# EAGLE design platform_smd (EAGLE 6.5.0)
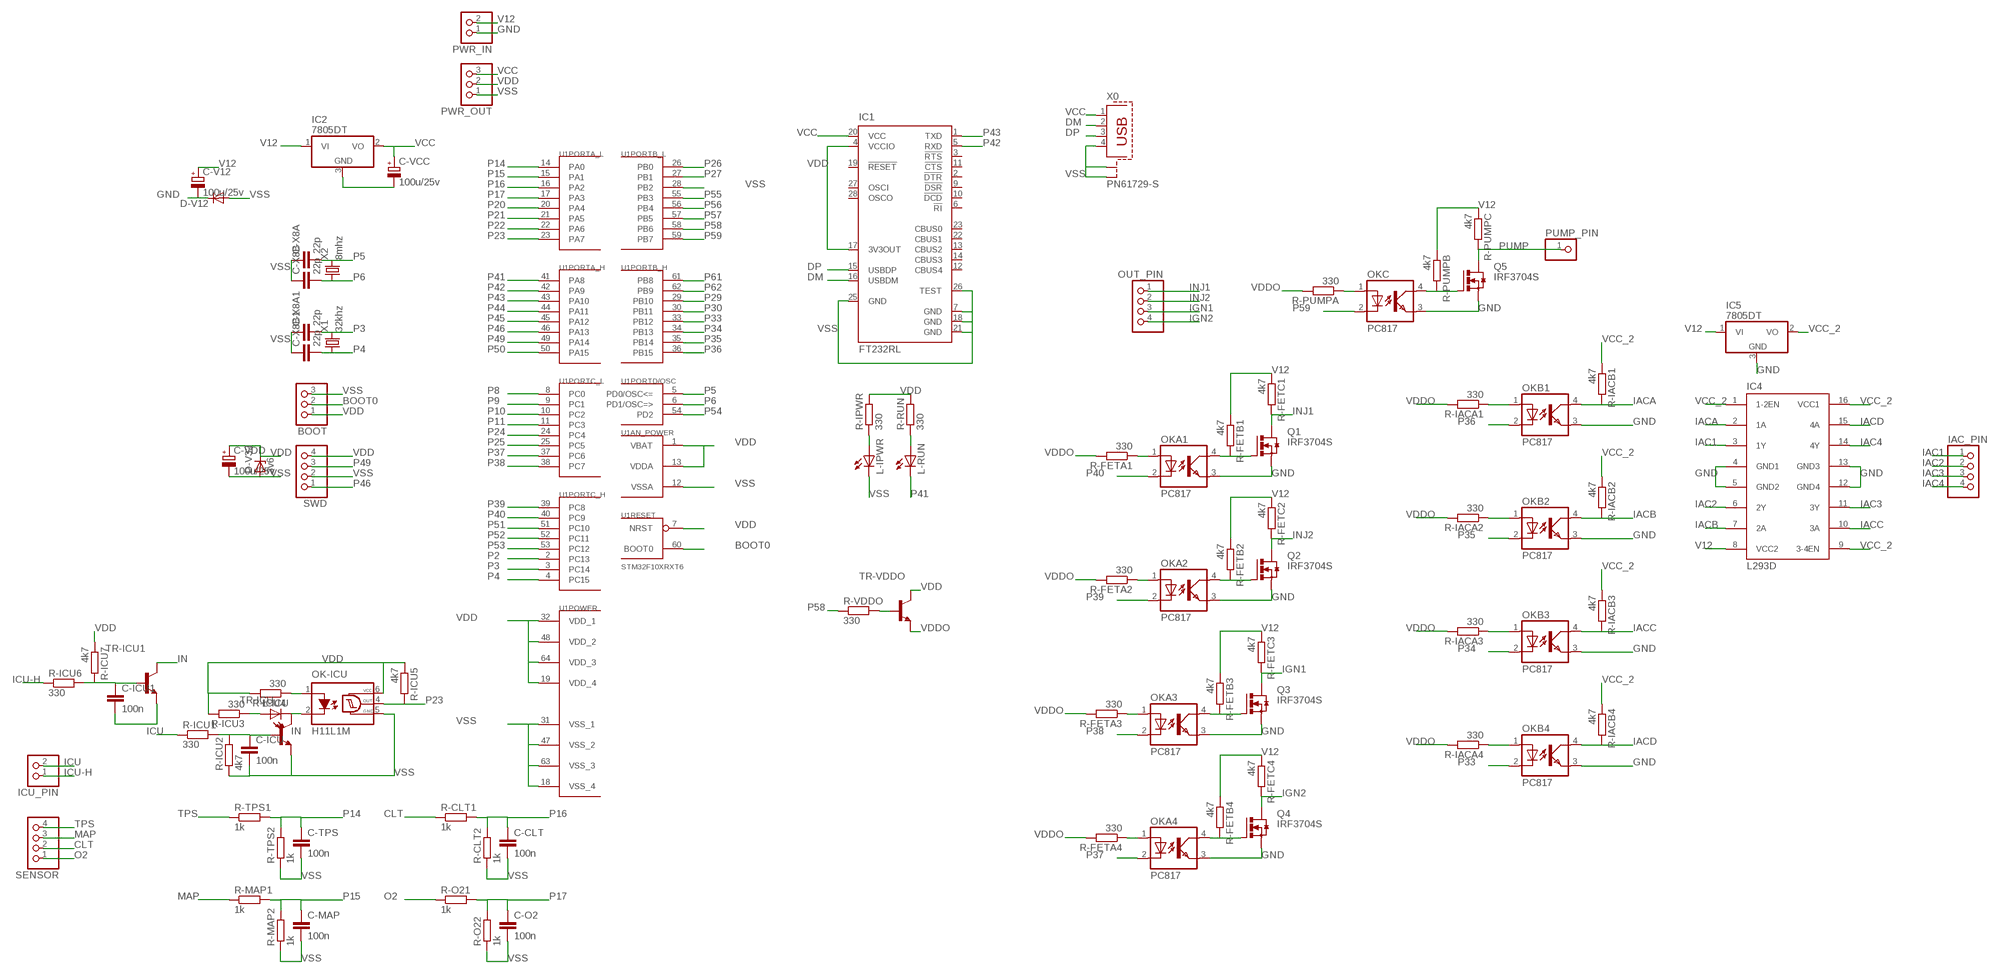
[diagram p0: schematic, sheet 1]

## Parts
BOOT  PINHD-1X3  [1X03]
C-CLT  100n  C-EUC0805  [C0805]
C-ICU  100n  C-EUC0805  [C0805]
C-ICU1  100n  C-EUC0805  [C0805]
C-MAP  100n  C-EUC0805  [C0805]
C-O2  100n  C-EUC0805  [C0805]
C-TPS  100n  C-EUC0805  [C0805]
C-V12  100u/25v  CPOL-EUD  [PANASONIC_D]
C-VCC  100u/25v  CPOL-EUD  [PANASONIC_D]
C-VDD  100u/25v  CPOL-EUD  [PANASONIC_D]
C-X8A  22p  C-EUC0805  [C0805]
C-X8A1  22p  C-EUC0805  [C0805]
C-X8B  22p  C-EUC0805  [C0805]
C-X8B1  22p  C-EUC0805  [C0805]
D-V12  DIODE-SMB  [SMB]
D-V33  3v6  ZENER-DIODESMB  [SMB]
IAC_PIN  PINHD-1X4  [1X04]
IC1  FT232RL  [SSOP28]
IC2  7805DT  [TO252]
IC4  L293D  [DIL16]
IC5  7805DT  [TO252]
ICU_PIN  PINHD-1X2  [1X02]
L-ICU  LEDSML0805  [SML0805]
L-IPWR  LEDSML0805  [SML0805]
L-RUN  LEDSML0805  [SML0805]
OK-ICU  H11L1M  [DIL06]
OKA1  PC817  [DIL04]
OKA2  PC817  [DIL04]
OKA3  PC817  [DIL04]
OKA4  PC817  [DIL04]
OKB1  PC817  [DIL04]
OKB2  PC817  [DIL04]
OKB3  PC817  [DIL04]
OKB4  PC817  [DIL04]
OKC  PC817  [DIL04]
OUT_PIN  PINHD-1X4  [1X04]
PUMP_PIN  PINHD-1X1  [1X01]
PWR_IN  PINHD-1X2  [1X02]
PWR_OUT  PINHD-1X3  [1X03]
Q1  IRF3704S  [D2PACK]
Q2  IRF3704S  [D2PACK]
Q3  IRF3704S  [D2PACK]
Q4  IRF3704S  [D2PACK]
Q5  IRF3704S  [D2PACK]
R-CLT1  1k  R-EU_R0805  [R0805]
R-CLT2  1k  R-EU_R0805  [R0805]
R-FETA1  330  R-EU_R0805  [R0805]
R-FETA2  330  R-EU_R0805  [R0805]
R-FETA3  330  R-EU_R0805  [R0805]
R-FETA4  330  R-EU_R0805  [R0805]
R-FETB1  4k7  R-EU_R0805  [R0805]
R-FETB2  4k7  R-EU_R0805  [R0805]
R-FETB3  4k7  R-EU_R0805  [R0805]
R-FETB4  4k7  R-EU_R0805  [R0805]
R-FETC1  4k7  R-EU_R0805  [R0805]
R-FETC2  4k7  R-EU_R0805  [R0805]
R-FETC3  4k7  R-EU_R0805  [R0805]
R-FETC4  4k7  R-EU_R0805  [R0805]
R-IACA1  330  R-EU_R0805  [R0805]
R-IACA2  330  R-EU_R0805  [R0805]
R-IACA3  330  R-EU_R0805  [R0805]
R-IACA4  330  R-EU_R0805  [R0805]
R-IACB1  4k7  R-EU_R0805  [R0805]
R-IACB2  4k7  R-EU_R0805  [R0805]
R-IACB3  4k7  R-EU_R0805  [R0805]
R-IACB4  4k7  R-EU_R0805  [R0805]
R-ICU1  330  R-EU_R0805  [R0805]
R-ICU2  4k7  R-EU_R0805  [R0805]
R-ICU3  330  R-EU_R0805  [R0805]
R-ICU4  330  R-EU_R0805  [R0805]
R-ICU5  4k7  R-EU_R0805  [R0805]
R-ICU6  330  R-EU_R0805  [R0805]
R-ICU7  4k7  R-EU_R0805  [R0805]
R-IPWR  330  R-EU_R0805  [R0805]
R-MAP1  1k  R-EU_R0805  [R0805]
R-MAP2  1k  R-EU_R0805  [R0805]
R-O21  1k  R-EU_R0805  [R0805]
R-O22  1k  R-EU_R0805  [R0805]
R-PUMPA  330  R-EU_R0805  [R0805]
R-PUMPB  4k7  R-EU_R0805  [R0805]
R-PUMPC  4k7  R-EU_R0805  [R0805]
R-RUN  330  R-EU_R0805  [R0805]
R-TPS1  1k  R-EU_R0805  [R0805]
R-TPS2  1k  R-EU_R0805  [R0805]
R-VDDO  330  R-EU_R0805  [R0805]
SENSOR  PINHD-1X4  [1X04]
SWD  PINHD-1X4  [1X04]
TR-ICU  MMBT3904LT1-NPN-SOT23-BEC  [SOT23-BEC]
TR-ICU1  MMBT3904LT1-NPN-SOT23-BEC  [SOT23-BEC]
TR-VDDO  MMBT3904LT1-NPN-SOT23-BEC  [SOT23-BEC]
U1  STM32F10XRXT6  [TQFP64]
X0  PN61729-S  [PN61729-S]
X1  32khz  CRYSTALTC26V  [TC26V]
X2  8mhz  CRYSTALHC49U-V  [HC49U-V]

## Nets
BOOT0: BOOT.2 U1.60(RESET:BOOT0)
CLT: R-CLT1.1 SENSOR.2
DM: IC1.16(USBDM) X0.2
DP: IC1.15(USBDP) X0.3
GND: C-V12.- D-V12.C IC4.4(GND1) IC4.5(GND2) IC4.12(GND4) IC4.13(GND3) IC5.3(GND) OKA1.3(EMIT) OKA2.3(EMIT) OKA3.3(EMIT) OKA4.3(EMIT) OKB1.3(EMIT) OKB2.3(EMIT) OKB3.3(EMIT) OKB4.3(EMIT) OKC.3(EMIT) PWR_IN.1 Q1.3(S) Q2.3(S) Q3.3(S) Q4.3(S) Q5.3(S)
IAC1: IAC_PIN.1 IC4.3(1Y)
IAC2: IAC_PIN.2 IC4.6(2Y)
IAC3: IAC_PIN.3 IC4.11(3Y)
IAC4: IAC_PIN.4 IC4.14(4Y)
IACA: IC4.2(1A) OKB1.4(COL) R-IACB1.2
IACB: IC4.7(2A) OKB2.4(COL) R-IACB2.2
IACC: IC4.10(3A) OKB3.4(COL) R-IACB3.2
IACD: IC4.15(4A) OKB4.4(COL) R-IACB4.2
ICU: ICU_PIN.2 R-ICU1.1
ICU-H: ICU_PIN.1 R-ICU6.1
IGN1: OUT_PIN.3 Q3.2(D) R-FETC3.2
IGN2: OUT_PIN.4 Q4.2(D) R-FETC4.2
IN: L-ICU.C OK-ICU.2(C) TR-ICU1.C TR-ICU.C
INJ1: OUT_PIN.1 Q1.2(D) R-FETC1.2
INJ2: OUT_PIN.2 Q2.2(D) R-FETC2.2
MAP: R-MAP1.1 SENSOR.3
N$1: C-ICU1.1 R-ICU6.2 R-ICU7.2 TR-ICU1.B
N$2: OKA2.4(COL) Q2.1(G) R-FETB2.2
N$3: C-ICU.1 R-ICU1.2 R-ICU2.2 TR-ICU.B
N$4: OKC.4(COL) Q5.1(G) R-PUMPB.2
N$5: OK-ICU.1(A) R-ICU4.1
N$6: L-ICU.A R-ICU3.1
N$7: L-IPWR.A R-IPWR.1
N$8: L-RUN.A R-RUN.1
N$9: OKC.1(A) R-PUMPA.1
N$10: OKB1.1(A) R-IACA1.1
N$11: OKA1.4(COL) Q1.1(G) R-FETB1.2
N$12: OKA2.1(A) R-FETA2.1
N$13: OKA1.1(A) R-FETA1.1
N$14: OKA3.4(COL) Q3.1(G) R-FETB3.2
N$15: OKA3.1(A) R-FETA3.1
N$16: OKA4.4(COL) Q4.1(G) R-FETB4.2
N$17: OKA4.1(A) R-FETA4.1
N$18: OKB2.1(A) R-IACA2.1
N$19: R-VDDO.2 TR-VDDO.B
N$21: OKB3.1(A) R-IACA3.1
N$22: OKB4.1(A) R-IACA4.1
O2: R-O21.1 SENSOR.1
P2: U1.2(PORTC_H:PC13)
P3: C-X8A1.2 U1.3(PORTC_H:PC14) X1.2
P4: C-X8B1.2 U1.4(PORTC_H:PC15) X1.1
P5: C-X8A.2 U1.5(PORTD/OSC:PD0/OSC<=) X2.2
P6: C-X8B.2 U1.6(PORTD/OSC:PD1/OSC=>) X2.1
P8: U1.8(PORTC_L:PC0)
P9: U1.9(PORTC_L:PC1)
P10: U1.10(PORTC_L:PC2)
P11: U1.11(PORTC_L:PC3)
P14: C-TPS.1 R-TPS1.2 R-TPS2.2 U1.14(PORTA_L:PA0)
P15: C-MAP.1 R-MAP1.2 R-MAP2.2 U1.15(PORTA_L:PA1)
P16: C-CLT.1 R-CLT1.2 R-CLT2.2 U1.16(PORTA_L:PA2)
P17: C-O2.1 R-O21.2 R-O22.2 U1.17(PORTA_L:PA3)
P20: U1.20(PORTA_L:PA4)
P21: U1.21(PORTA_L:PA5)
P22: U1.22(PORTA_L:PA6)
P23: OK-ICU.4(OUT) R-ICU5.2 U1.23(PORTA_L:PA7)
P24: U1.24(PORTC_L:PC4)
P25: U1.25(PORTC_L:PC5)
P26: U1.26(PORTB_L:PB0)
P27: U1.27(PORTB_L:PB1)
P29: U1.29(PORTB_H:PB10)
P30: U1.30(PORTB_H:PB11)
P33: OKB4.2(C) U1.33(PORTB_H:PB12)
P34: OKB3.2(C) U1.34(PORTB_H:PB13)
P35: OKB2.2(C) U1.35(PORTB_H:PB14)
P36: OKB1.2(C) U1.36(PORTB_H:PB15)
P37: OKA4.2(C) U1.37(PORTC_L:PC6)
P38: OKA3.2(C) U1.38(PORTC_L:PC7)
P39: OKA2.2(C) U1.39(PORTC_H:PC8)
P40: OKA1.2(C) U1.40(PORTC_H:PC9)
P41: L-RUN.C U1.41(PORTA_H:PA8)
P42: IC1.5(RXD) U1.42(PORTA_H:PA9)
P43: IC1.1(TXD) U1.43(PORTA_H:PA10)
P44: U1.44(PORTA_H:PA11)
P45: U1.45(PORTA_H:PA12)
P46: SWD.1 U1.46(PORTA_H:PA13)
P49: SWD.3 U1.49(PORTA_H:PA14)
P50: U1.50(PORTA_H:PA15)
P51: U1.51(PORTC_H:PC10)
P52: U1.52(PORTC_H:PC11)
P53: U1.53(PORTC_H:PC12)
P54: U1.54(PORTD/OSC:PD2)
P55: U1.55(PORTB_L:PB3)
P56: U1.56(PORTB_L:PB4)
P57: U1.57(PORTB_L:PB5)
P58: R-VDDO.1 U1.58(PORTB_L:PB6)
P59: OKC.2(C) U1.59(PORTB_L:PB7)
P61: U1.61(PORTB_H:PB8)
P62: U1.62(PORTB_H:PB9)
PUMP: PUMP_PIN.1 Q5.2(D) R-PUMPC.2
TPS: R-TPS1.1 SENSOR.4
V12: C-V12.+ IC2.1(VI) IC4.8(VCC2) IC5.1(VI) PWR_IN.2 R-FETB1.1 R-FETB2.1 R-FETB3.1 R-FETB4.1 R-FETC1.1 R-FETC2.1 R-FETC3.1 R-FETC4.1 R-PUMPB.1 R-PUMPC.1
VCC: C-VCC.+ IC1.20(VCC) IC2.2(VO) PWR_OUT.3 X0.1
VCC_2: IC4.1(1-2EN) IC4.9(3-4EN) IC4.16(VCC1) IC5.2(VO) R-IACB1.1 R-IACB2.1 R-IACB3.1 R-IACB4.1
VDD: BOOT.1 C-VDD.+ D-V33.C IC1.4(VCCIO) IC1.17(3V3OUT) OK-ICU.6(VCC) PWR_OUT.2 R-ICU3.2 R-ICU4.2 R-ICU5.1 R-ICU7.1 R-IPWR.2 R-RUN.2 SWD.4 TR-VDDO.C U1.1(AN_POWER:VBAT) U1.7(RESET:NRST) U1.13(AN_POWER:VDDA) U1.19(POWER:VDD_4) U1.32(POWER:VDD_1) U1.48(POWER:VDD_2) U1.64(POWER:VDD_3)
VDDO: R-FETA1.2 R-FETA2.2 R-FETA3.2 R-FETA4.2 R-IACA1.2 R-IACA2.2 R-IACA3.2 R-IACA4.2 R-PUMPA.2 TR-VDDO.E
VSS: BOOT.3 C-CLT.2 C-ICU.2 C-MAP.2 C-O2.2 C-TPS.2 C-VCC.- C-VDD.- C-X8A1.1 C-X8A.1 C-X8B1.1 C-X8B.1 D-V12.A D-V33.A IC1.7(GND) IC1.18(GND) IC1.21(GND) IC1.25(GND) IC1.26(TEST) IC2.3(GND) L-IPWR.C OK-ICU.5(GND) PWR_OUT.1 R-CLT2.1 R-ICU2.1 R-MAP2.1 R-O22.1 R-TPS2.1 SWD.2 TR-ICU.E U1.12(AN_POWER:VSSA) U1.18(POWER:VSS_4) U1.28(PORTB_L:PB2) U1.31(POWER:VSS_1) U1.47(POWER:VSS_2) U1.63(POWER:VSS_3) X0.4 X0.S1 X0.S2
VSS1: C-ICU1.2 TR-ICU1.E
Unconnected: IC1.2(!DTR) IC1.3(!RTS) IC1.6(!RI) IC1.9(!DSR) IC1.10(!DCD) IC1.11(!CTS) IC1.12(CBUS4) IC1.13(CBUS2) IC1.14(CBUS3) IC1.19(!RESET) IC1.22(CBUS1) IC1.23(CBUS0) IC1.27(OSCI) IC1.28(OSCO)

## Library data of the parts
BOOT PWR_OUT = pinhead:PINHD-1X3: PIN HEADER
C-CLT C-ICU C-ICU1 C-MAP C-O2 C-TPS C-X8A C-X8A1 C-X8B C-X8B1 = resistor:C-EU: CAPACITOR, European symbol
C-V12 C-VCC C-VDD = resistor:CPOL-EU: POLARIZED CAPACITOR, European symbol
D-V12 = diode:DIODE-: DIODE
D-V33 = diode:ZENER-DIODE: Z-Diode
IAC_PIN OUT_PIN SENSOR SWD = pinhead:PINHD-1X4: PIN HEADER
IC1 = ftdichip:FT232R: Source: http://www.ftdichip.com/Documents/DataSheets/DS_FT232R_v104.pdf; MPN: FT232RL; OC_FARNELL: 1146032; OC_NEWARK: 91K9918
IC2 IC5 = linear:78*: Positive VOLTAGE REGULATOR Source: http://cache.national.com/ds/LM/LM78L05.pdf http://www.fairchildsemi.com/ds/LM/LM7805.pdf
IC4 = st-microelectronics:L293D: PUSH-PULL 4 CHANNEL DRIVER; MPN: L293D; OC_FARNELL: 9589619; OC_NEWARK: 56P8249
ICU_PIN PWR_IN = pinhead:PINHD-1X2: PIN HEADER
L-ICU L-IPWR L-RUN = led:LED: LED OSRAM: - CHIPLED LG R971, LG N971, LY N971, LG Q971, LY Q971, LO R971, LY R971 LH N974, LH R974 LS Q976, LO Q976, LY Q976 LO Q996 - Hyper CHIPLED LW Q18S LB Q993, LB Q99A, LB R99A - SideLED LS A670, LO A670, LY A670, LG A670, LP A670 LB A673, LV A673, LT A673, LW A673 LH A674 LY A675 LS A676, LA A676, LO A676, LY A676, LW A676 LS A679, LY A679, LG A679 - Hyper Micro SIDELED® LS Y876, LA Y876, LO Y876, LY Y876 LT Y87S - SmartLED LW L88C, LW L88S LB L89C, LB L89S, LG L890 LS L89K, LO L89K, LY L89K LS L896, LA L896, LO L896, LY L896 - TOPLED LS T670, LO T670, LY T670, LG T670, LP T670 LSG T670, LSP T670, LSY T670, LOP T670, LYG T670 LG T671, LOG T671, LSG T671 LB T673, LV T673, LT T673, LW T673 LH T674 LS T676, LA T676, LO T676, LY T676, LB T676, LH T676, LSB T676, LW T676 LB T67C, LV T67C, LT T67C, LS T67K, LO T67K, LY T67K, LW E67C LS E67B, LA E67B, LO E67B, LY E67B, LB E67C, LV E67C, LT E67C LW T67C LS T679, LY T679, LG T679 LS T770, LO T770, LY T770, LG T770, LP T770 LB T773, LV T773, LT T773, LW T773 LH T774 LS E675, LA E675, LY E675, LS T675 LS T776, LA T776, LO T776, LY T776, LB T776 LHGB T686 LT T68C, LB T68C - Hyper Mini TOPLED® LB M676 - Mini TOPLED Santana® LG M470 LS M47K, LO M47K, LY M47K Source: http://www.osram.convergy.de LUXEON: - LUMILED® LXK2-PW12-R00, LXK2-PW12-S00, LXK2-PW14-U00, LXK2-PW14-V00 LXK2-PM12-R00, LXK2-PM12-S00, LXK2-PM14-U00 LXK2-PE12-Q00, LXK2-PE12-R00, LXK2-PE12-S00, LXK2-PE14-T00, LXK2-PE14-U00 LXK2-PB12-K00, LXK2-PB12-L00, LXK2-PB12-M00, LXK2-PB14-N00, LXK2-PB14-P00, LXK2-PB14-Q00 LXK2-PR12-L00, LXK2-PR12-M00, LXK2-PR14-Q00, LXK2-PR14-R00 LXK2-PD12-Q00, LXK2-PD12-R00, LXK2-PD12-S00 LXK2-PH12-R00, LXK2-PH12-S00 LXK2-PL12-P00, LXK2-PL12-Q00, LXK2-PL12-R00 Source: www.luxeon.com KINGBRIGHT: KA-3528ASYC Source: www.kingbright.com
OK-ICU = optocoupler:H11L*M: 6-Pin DIP Optocoupler Source: http://www.fairchildsemi.com/ds/H1/H11L2-M.pdf; MF: FAIRCHILD SEMICONDUCTOR; MPN: H11L1-M; OC_FARNELL: 1021127; OC_NEWARK: 72K8643
OKA1-OKA4 OKB1-OKB4 OKC = optocoupler:PC817: SHARP OPTO COUPLER; MPN: PC817X4J000F; OC_FARNELL: 9707727; OC_NEWARK: 97K7059
PUMP_PIN = pinhead:PINHD-1X1: PIN HEADER
Q1-Q5 = transistor-power:IRF3704: SMPS MOSFET HEXFET® Power MOSFET Source: http://www.irf.com/product-info/datasheets/data/irf3704.pdf
R-CLT1 R-CLT2 R-FETA1-R-FETA4 R-FETB1-R-FETB4 R-FETC1-R-FETC4 R-IACA1-R-IACA4 R-IACB1-R-IACB4 R-ICU1-R-ICU7 R-IPWR R-MAP1 R-MAP2 R-O21 R-O22 R-PUMPA R-PUMPB R-PUMPC R-RUN R-TPS1 R-TPS2 R-VDDO = resistor:R-EU_: RESISTOR, European symbol
TR-ICU TR-ICU1 TR-VDDO = transistor:*-NPN-: NPN Transistror BF959 corrected 2008.03.06
U1 = stm32:STM32F10XRXT6: STM32F101/103 64pin LQFP
X0 = con-berg:PN61729-S: BERG USB connector; OC_FARNELL: unknown; OC_NEWARK: unknown
X1 = crystal:CRYSTAL: CRYSTAL; OC_FARNELL: unknown; OC_NEWARK: unknown
X2 = crystal:CRYSTAL: CRYSTAL; OC_FARNELL: 1666969; OC_NEWARK: unknown

## Board
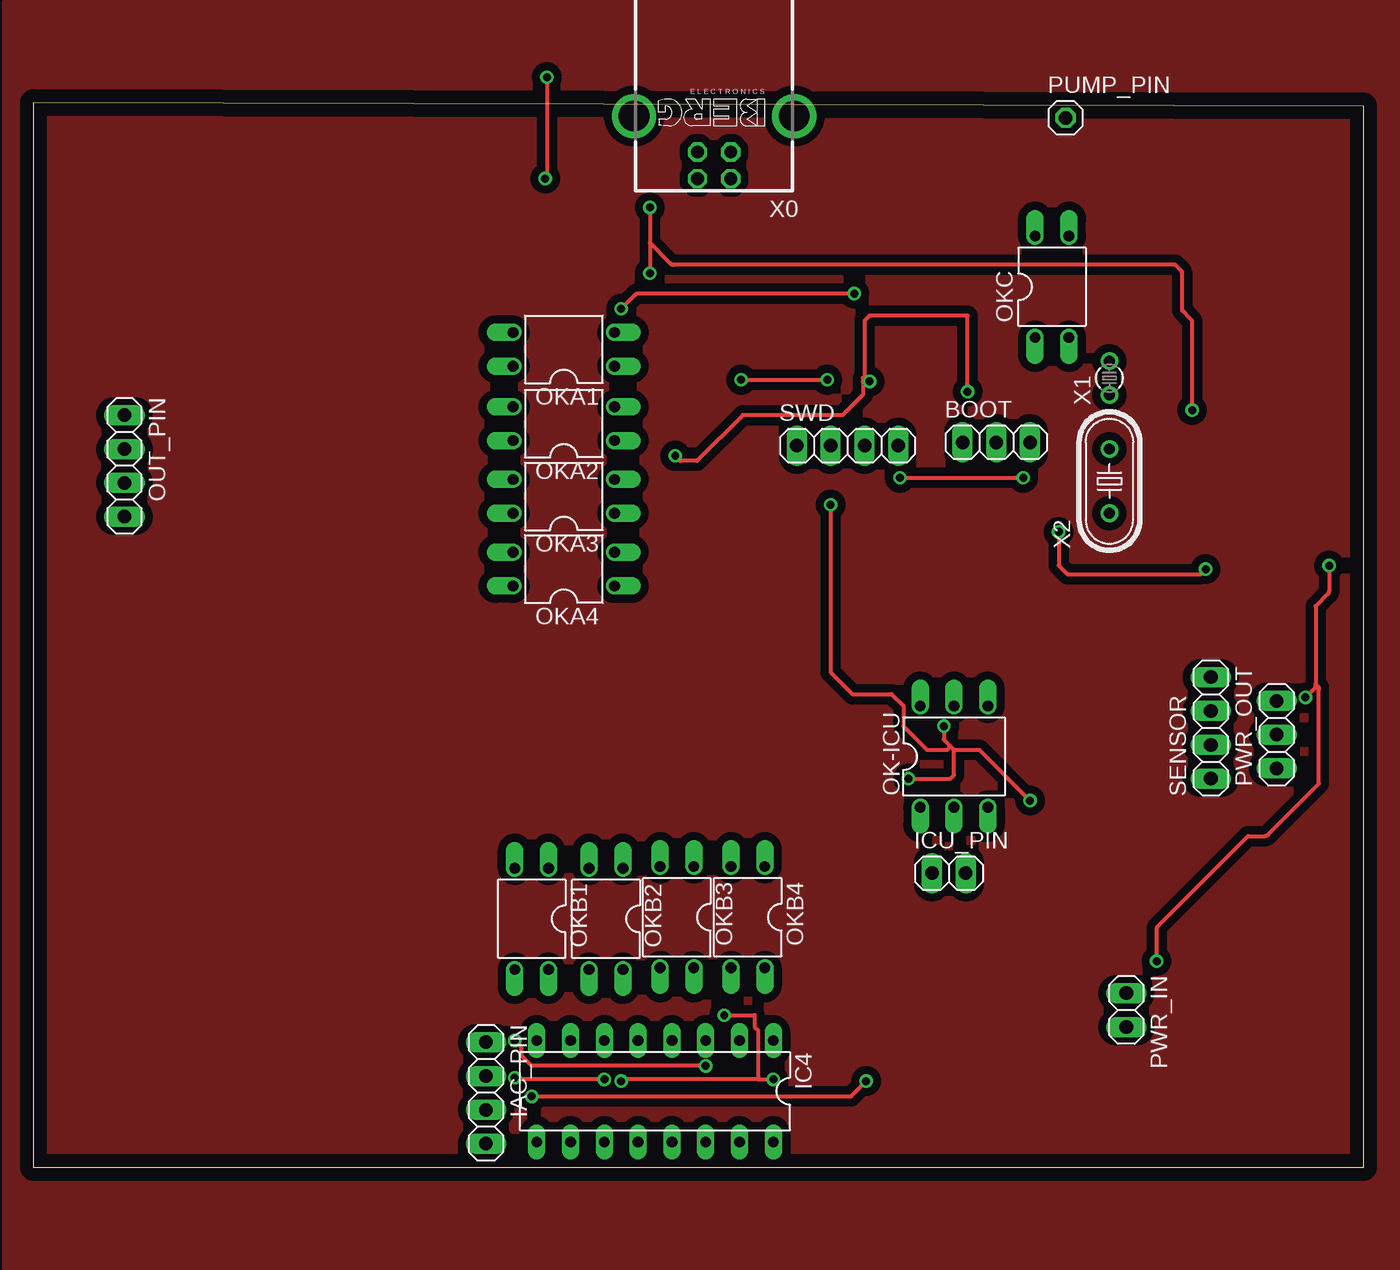
[diagram p1: board, top side]
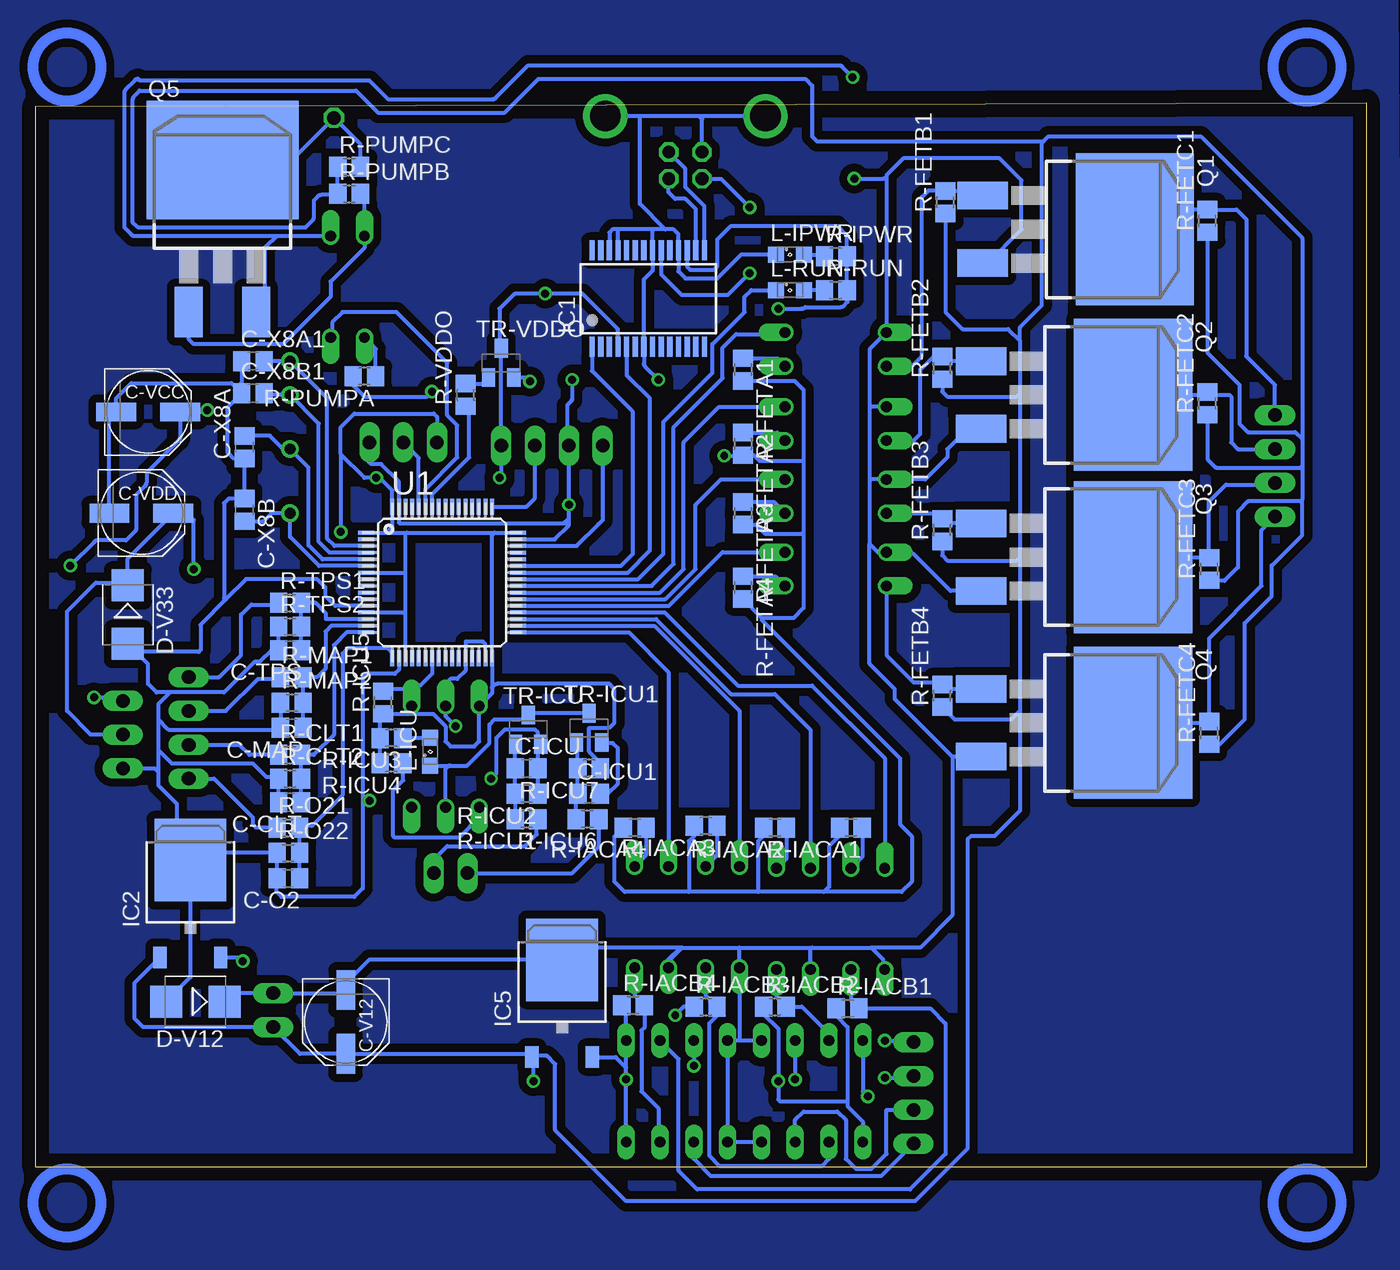
[diagram p2: board, bottom side, seen from below]

Size 100 x 80 mm. Coordinates in mm from the lower left corner, seen from the top.
Outline: 0,0 100,0 100,79.75 0,80 0,0
Copper layers (1*16): Top 0.035mm / dielectric 1.5mm / Bottom 0.035mm
Design rules "default": minimum track width 10mil, minimum drill 24mil, track to track 8mil, track to pad 8mil, pad to pad 8mil, via to via 8mil, smd to smd 8mil, copper to edge 40mil, drill to drill 8mil, minimum pad ring 10mil, minimum via ring 8mil, stop-mask expansion 4mil, vias tented up to drill 0mil, thermal gap 10mil

### Footprints (pad centres in the part's own frame; a part is rotated, then mirrored left to right if it is on the bottom)
1X03 = drill 1.016 long: 1 -2.54,0; 2 0,0; 3 2.54,0
C0805 = smd 1.3 x 1.5: 1 -0.85,0; 2 0.85,0
PANASONIC_D = smd 3 x 1.4: + 2.4,0; - -2.4,0
SMB = smd 2.4 x 2.4: A 2.2,0; C -2.2,0
1X04 = drill 1.016 long: 1 -3.81,0; 2 -1.27,0; 3 1.27,0; 4 3.81,0
SSOP28 = smd 0.4 x 1.5: 1 -4.225,-3.625; 2 -3.575,-3.625; 3 -2.925,-3.625; 4 -2.275,-3.625; 5 -1.625,-3.625; 6 -0.975,-3.625; 7 -0.325,-3.625; 8 0.325,-3.625; 9 0.975,-3.625; 10 1.625,-3.625; 11 2.275,-3.625; 12 2.925,-3.625; 13 3.575,-3.625; 14 4.225,-3.625; 15 4.225,3.625; 16 3.575,3.625; 17 2.925,3.625; 18 2.275,3.625; 19 1.625,3.625; 20 0.975,3.625; 21 0.325,3.625; 22 -0.325,3.625; 23 -0.975,3.625; 24 -1.625,3.625; 25 -2.275,3.625; 26 -2.925,3.625; 27 -3.575,3.625; 28 -4.225,3.625
TO252 = smd 1 x 1.6: 1 -2.28,-4.8; 2 2.28,-4.8 | smd 5.4 x 6.2: 3 0,2.5
DIL16 = drill 0.813 long: 1 -8.89,-3.81; 2 -6.35,-3.81; 3 -3.81,-3.81; 4 -1.27,-3.81; 5 1.27,-3.81; 6 3.81,-3.81; 7 6.35,-3.81; 8 8.89,-3.81; 9 8.89,3.81; 10 6.35,3.81; 11 3.81,3.81; 12 1.27,3.81; 13 -1.27,3.81; 14 -3.81,3.81; 15 -6.35,3.81; 16 -8.89,3.81
1X02 = drill 1.016 long: 1 -1.27,0; 2 1.27,0
SML0805 = smd 1.2 x 1.2: A 1.05,0; C -1.05,0
DIL06 = drill 0.813 offset: 1 -2.54,-3.81; 2 0,-3.81; 3 2.54,-3.81; 4 2.54,3.81; 5 0,3.81; 6 -2.54,3.81
DIL04 = drill 0.813 offset: 1 -1.27,-3.81; 2 1.27,-3.81; 3 1.27,3.81; 4 -1.27,3.81
1X01 = drill 1.016 octagon: 1 0,0
D2PACK = smd 2.083 x 3.81: 1 -2.54,-8.89; 3 2.54,-8.89 | smd 11.43 x 8.89: 2 0,2.54
R0805 = smd 1.3 x 1.5: 1 -0.85,0; 2 0.85,0
SOT23-BEC = smd 1 x 1.4: B -0.95,-1.1; C 0,1.1; E 0.95,-1.1
TQFP64 = smd 1.2 x 0.3: 1 -5.7,3.75; 2 -5.7,3.25; 3 -5.7,2.75; 4 -5.7,2.25; 5 -5.7,1.75; 6 -5.7,1.25; 7 -5.7,0.75; 8 -5.7,0.25; 9 -5.7,-0.25; 10 -5.7,-0.75; 11 -5.7,-1.25; 12 -5.7,-1.75; 13 -5.7,-2.25; 14 -5.7,-2.75; 15 -5.7,-3.25; 16 -5.7,-3.75; 33 5.7,-3.75; 34 5.7,-3.25; 35 5.7,-2.75; 36 5.7,-2.25; 37 5.7,-1.75; 38 5.7,-1.25; 39 5.7,-0.75; 40 5.7,-0.25; 41 5.7,0.25; 42 5.7,0.75; 43 5.7,1.25; 44 5.7,1.75; 45 5.7,2.25; 46 5.7,2.75; 47 5.7,3.25; 48 5.7,3.75 | smd 0.3 x 1.2: 17 -3.75,-5.7; 18 -3.25,-5.7; 19 -2.75,-5.7; 20 -2.25,-5.7; 21 -1.75,-5.7; 22 -1.25,-5.7; 23 -0.75,-5.7; 24 -0.25,-5.7; 25 0.25,-5.7; 26 0.75,-5.7; 27 1.25,-5.7; 28 1.75,-5.7; 29 2.25,-5.7; 30 2.75,-5.7; 31 3.25,-5.7; 32 3.75,-5.7; 49 3.75,5.7; 50 3.25,5.7; 51 2.75,5.7; 52 2.25,5.7; 53 1.75,5.7; 54 1.25,5.7; 55 0.75,5.7; 56 0.25,5.7; 57 -0.25,5.7; 58 -0.75,5.7; 59 -1.25,5.7; 60 -1.75,5.7; 61 -2.25,5.7; 62 -2.75,5.7; 63 -3.25,5.7; 64 -3.75,5.7
PN61729-S = drill 0.95 octagon: 1 1.25,4.71; 2 -1.25,4.71; 3 -1.25,2.71; 4 1.25,2.71 | drill 2.3 pad 2.9: S1 -6.02,0; S2 6.02,0
TC26V = drill 0.813: 1 -1.27,0; 2 1.27,0
HC49U-V = drill 0.813: 1 -2.413,0; 2 2.413,0

### Placement (x,y rotation side)
BOOT  72.39,54.48 0 top
C-CLT  80.9,27.43 180 bottom
C-ICU  63.12,29.97 0 bottom
C-ICU1  58.42,28.07 0 bottom
C-MAP  80.77,33.02 180 bottom
C-O2  81.03,21.72 180 bottom
C-TPS  80.9,38.86 180 bottom
C-V12  76.71,10.92 270 bottom
C-VCC  91.57,56.77 0 bottom
C-VDD  92.08,49.15 0 bottom
C-X8A  84.33,54.1 90 bottom
C-X8A1  83.69,60.58 0 bottom
C-X8B  84.33,49.4 270 bottom
C-X8B1  83.69,58.17 0 bottom
D-V12  88.01,12.45 180 bottom
D-V33  93.09,41.53 270 bottom
IAC_PIN  34.04,5.59 270 top
IC1  53.98,65.28 0 bottom
IC2  88.39,20.57 0 bottom
IC4  46.74,5.71 180 top
IC5  60.45,13.08 0 bottom
ICU_PIN  68.83,22.1 0 top
L-ICU  70.36,31.24 90 bottom
L-IPWR  43.31,68.58 0 bottom
L-RUN  43.31,65.91 0 bottom
OK-ICU  69.22,30.86 0 top
OKA1  39.88,61.47 90 top
OKA2  39.88,55.88 90 top
OKA3  39.88,50.42 90 top
OKA4  39.88,44.96 90 top
OKB1  37.47,18.67 180 top
OKB2  43.05,18.67 180 top
OKB3  48.39,18.8 180 top
OKB4  53.72,18.8 180 top
OKC  76.58,66.17 0 top
OUT_PIN  6.86,52.7 270 top
PUMP_PIN  77.6,78.87 0 top
PWR_IN  82.17,11.81 270 top
PWR_OUT  93.47,32.51 90 top
Q1  19.94,70.48 270 bottom
Q2  20.07,58.04 270 bottom
Q3  20.07,45.85 270 bottom
Q4  20.07,33.4 270 bottom
Q5  85.98,73.15 0 bottom
R-CLT1  80.9,30.99 0 bottom
R-CLT2  80.9,29.21 0 bottom
R-FETA1  46.86,59.94 270 bottom
R-FETA2  46.86,54.36 270 bottom
R-FETA3  46.86,49.15 270 bottom
R-FETA4  46.86,43.56 270 bottom
R-FETB1  31.62,72.52 90 bottom
R-FETB2  31.88,60.07 90 bottom
R-FETB3  31.88,47.88 90 bottom
R-FETB4  31.88,35.43 90 bottom
R-FETC1  11.94,71.12 90 bottom
R-FETC2  11.94,57.4 90 bottom
R-FETC3  11.81,44.96 90 bottom
R-FETC4  11.81,32.64 90 bottom
R-IACA1  38.73,25.53 180 bottom
R-IACA2  44.45,25.53 180 bottom
R-IACA3  49.66,25.65 180 bottom
R-IACA4  54.99,25.53 180 bottom
R-IACB1  38.99,11.94 0 bottom
R-IACB2  44.45,12.06 0 bottom
R-IACB3  49.66,12.06 0 bottom
R-IACB4  55.12,12.19 0 bottom
R-ICU1  63.12,26.16 180 bottom
R-ICU2  63.12,28.07 180 bottom
R-ICU3  73.28,32.26 180 bottom
R-ICU4  73.28,30.35 180 bottom
R-ICU5  73.91,34.92 90 bottom
R-ICU6  58.55,26.16 180 bottom
R-ICU7  58.42,29.97 180 bottom
R-IPWR  39.88,68.45 0 bottom
R-MAP1  80.77,36.83 0 bottom
R-MAP2  80.77,34.92 0 bottom
R-O21  81.03,25.53 0 bottom
R-O22  81.03,23.62 0 bottom
R-PUMPA  75.31,59.44 180 bottom
R-PUMPB  76.45,73.15 0 bottom
R-PUMPC  76.45,75.18 0 bottom
R-RUN  39.88,65.91 0 bottom
R-TPS1  80.9,42.42 0 bottom
R-TPS2  80.9,40.64 0 bottom
R-VDDO  67.69,58.04 90 bottom
SENSOR  88.52,33.02 90 top
SWD  61.21,54.23 0 top
TR-ICU  62.99,32.89 0 bottom
TR-ICU1  58.42,33.02 0 bottom
TR-VDDO  65.02,60.45 0 bottom
U1  69.47,43.94 0 bottom
X0  51.18,78.99 180 top
X1  80.9,59.31 90 top
X2  80.9,51.56 90 top

### Tracks (layer width: path | path; a pad name or v marks a point on that pad's centre or on a via)
BOOT0
  Bottom 0.305: U1.60 71.22,53.31 BOOT.2
CLT
  Bottom 0.305: SENSOR.2 84.71,31.75 83.95,30.99 R-CLT1.1
DM
  Bottom 0.305: IC1.16 50.4,71.99 51.18,72.77 51.94,72.77 52.45,73.28 52.45,74.26 X0.2
DP
  Bottom 0.305: IC1.15 49.75,72.23 51.18,73.66 51.18,75.03 X0.3
GND  (via drill 0.6)
  Top 0.305: v38.61,81.92 38.61,74.55 arc-45 38.52,74.33 v38.48,74.3
  Bottom 0.305: Q5.3 82.8,64.9 82.8,69.09 81.92,69.98 OKC.3 92.58,69.98 arc45 92.8,70.07 93.34,70.61 93.34,80.77 arc45 93.25,80.99 92.55,81.69 arc45 92.32,81.79 92.29,81.75 arc-45 92.07,81.66 74.93,81.66 73.53,80.26 65.66,80.26 arc-45 65.44,80.36 62.99,82.8 39.63,82.8 arc45 39.4,82.71 v38.61,81.92 | Q1.3 28.45,67.94 25.91,70.48 25.91,74.17 27.56,75.82 34.8,75.82 36.07,74.55 36.07,74.42 | 36.07,74.42 OKA1.3 37.34,61.47 37.34,57.02 | 37.34,57.02 37.34,51.56 | 37.34,51.56 37.34,46.86 | 37.34,46.86 36.7,46.23 | 36.7,46.23 OKA4.3 | 37.34,51.56 37.21,51.69 OKA3.3 33.15,51.69 31.5,53.34 31.5,53.98 29.97,55.5 Q2.3 | OKA2.3 37.21,57.15 37.34,57.02 | Q3.3 31.24,43.31 34.04,46.1 36.58,46.1 36.7,46.23 | Q4.3 31.11,30.86 | 31.11,30.86 35.43,35.18 35.43,35.94 37.34,37.85 37.34,46.86 | OKB4.3 52.45,15.49 | 52.45,15.49 51.44,16.51 47.12,16.51 | 47.12,16.51 41.66,16.51 | 41.66,16.51 37.21,16.51 | 37.21,16.51 36.32,15.62 36.32,14.99 OKB1.3 | OKB2.3 41.78,16.38 41.66,16.51 | 47.12,16.51 OKB3.3 47.12,9.65 46.99,9.53 | IC4.5 46.99,9.53 | 46.99,9.53 IC4.4 IC4.13 IC4.12 | D-V12.C 85.18,13.08 PWR_IN.1 76.95,13.08 C-V12.- 76.72,13.34 77.22,13.34 74.97,15.58 IC5.3 59.52,16.51 51.56,16.51 52.45,15.62 52.45,15.49 | 31.11,30.86 31.11,18.92 33.53,16.51 37.21,16.51 | v38.48,74.3 36.33,74.3 arc-45 36.1,74.39 36.07,74.42
IAC1  (via drill 0.6)
  Top 0.305: v50.55,7.62 37.47,7.62 36.7,8.38 36.7,9.02 v36.2,9.53
  Bottom 0.305: IC4.3 v50.55,7.62 | v36.2,9.53 34.16,9.53 IAC_PIN.1
IAC2  (via drill 0.6)
  Top 0.305: v42.93,6.6 36.32,6.6 v36.2,6.73
  Bottom 0.305: IC4.6 v42.93,6.6 | v36.2,6.73 34.16,6.73 IAC_PIN.2
IAC3
  Bottom 0.305: IC4.11 42.93,3.56 42.29,4.19 39.75,4.19 39.12,3.56 39.12,0.64 38.35,-0.13 37.21,-0.13 36.07,1.02 36.07,4.32 IAC_PIN.3
IAC4
  Bottom 0.305: IC4.14 50.55,0.64 49.28,-0.64 36.45,-0.64 IAC_PIN.4
IACA
  Bottom 0.305: OKB1.4 38.73,12.53 R-IACB1.2 32.77,11.94 31.62,10.79 31.62,1.02 34.29,-1.65 50.29,-1.65 51.69,-0.25 51.69,8.13 IC4.2
IACB
  Bottom 0.305: OKB2.4 44.32,12.79 R-IACB2.2 42.42,12.06 40.51,10.16 40.51,9.65 IC4.7
IACC
  Bottom 0.305: OKB3.4 49.66,12.91 R-IACB3.2 48.81,11.39 49.4,10.79 49.4,0.89 48.64,0.13 40.89,0.13 40.39,0.64 IC4.10
IACD
  Bottom 0.305: OKB4.4 54.99,12.91 R-IACB4.2 54.27,10.5 54.48,10.29 54.48,5.71 53.21,4.45 53.21,2.03 IC4.15
ICU
  Bottom 0.305: ICU_PIN.2 70.1,23.11 69.09,24.13 63.25,24.13 62.36,25.02 62.36,26.07 R-ICU1.1
ICU-H
  Bottom 0.305: ICU_PIN.1 59.69,22.1 57.66,24.13 57.66,26.12 R-ICU6.1
IGN1
  Bottom 0.305: Q3.2 11.85,45.85 | 11.85,45.85 R-FETC3.2 | 11.85,45.85 11.85,50 10.54,51.31 6.99,51.31 OUT_PIN.3
IGN2
  Bottom 0.305: Q4.2 11.9,33.4 R-FETC4.2 11.81,39.75 7.87,43.69 7.87,47.88 OUT_PIN.4
IN
  Bottom 0.305: TR-ICU1.C 62.87,34.12 TR-ICU.C 63.33,33.66 65.53,33.66 65.91,33.27 65.91,31.88 67.6,30.19 68.83,30.19 68.96,30.19 | OK-ICU.2 69.22,29.94 68.96,30.19 | L-ICU.C 68.96,30.19
INJ1
  Bottom 0.305: Q1.2 15.91,71.97 R-FETC1.2 9.74,71.97 9.02,71.25 9.02,60.96 6.86,58.8 OUT_PIN.1
INJ2
  Bottom 0.305: Q2.2 12.15,58.04 | 12.15,58.04 R-FETC2.2 | 12.15,58.04 10.29,58.04 10.16,57.91 10.16,54.48 9.65,53.98 OUT_PIN.2
MAP
  Bottom 0.305: SENSOR.3 85.72,34.29 83.31,36.7 81.75,36.7 R-MAP1.1
N$1
  Bottom 0.305: R-ICU6.2 59.4,27.94 C-ICU1.1 R-ICU7.2 59.27,31.82 TR-ICU1.B
N$2
  Bottom 0.305: Q2.1 31.54,60.58 R-FETB2.2 31.92,60.96 32.51,60.96 33.53,59.94 33.53,55.12 34.04,54.61 OKA2.4
N$3
  Bottom 0.305: TR-ICU.B 63.97,31.77 C-ICU.1 R-ICU2.2 R-ICU1.2
N$4
  Bottom 0.305: R-PUMPB.2 75.31,72.86 OKC.4 75.31,69.09 77.85,66.55 77.85,65.41 81.41,61.85 88.14,61.85 88.52,62.23 Q5.1
N$5
  Bottom 0.305: OK-ICU.1 66.67,26.29 68.2,24.77 73.03,24.77 73.15,24.89 73.15,28.32 72.39,29.08 72.39,30.31 R-ICU4.1
N$6
  Bottom 0.305: R-ICU3.1 72.39,32.29 L-ICU.A
N$7
  Bottom 0.305: L-IPWR.A 40.85,68.58 R-IPWR.1
N$8
  Bottom 0.305: R-RUN.1 L-RUN.A
N$9
  Bottom 0.305: R-PUMPA.1 74.46,61.51 OKC.1
N$10
  Bottom 0.305: R-IACA1.1 37.88,23.33 OKB1.1
N$11
  Bottom 0.305: Q1.1 29.17,73.37 R-FETB1.2 31.66,73.41 32.89,73.41 33.4,72.9 33.4,60.96 34.16,60.2 OKA1.4
N$12
  Bottom 0.305: R-FETA2.1 44.28,55.21 OKA2.1
N$13
  Bottom 0.305: R-FETA1.1 44.28,60.79 OKA1.1
N$14
  Bottom 0.305: OKA3.4 32.38,49.15 | 32.38,49.15 32.3,49.15 R-FETB3.2 | Q3.1 31.62,48.39 32.38,49.15
N$15
  Bottom 0.305: R-FETA3.1 44.54,50 OKA3.1
N$16
  Bottom 0.305: Q4.1 31.54,35.94 R-FETB4.2 32.04,36.45 34.04,36.45 36.07,38.48 OKA4.4
N$17
  Bottom 0.305: R-FETA4.1 44.41,44.41 OKA4.1
N$18
  Bottom 0.305: R-IACA2.1 43.6,23.2 OKB2.1
N$19
  Bottom 0.305: R-VDDO.2 66.44,58.89 TR-VDDO.B
N$20
  pour Bottom (isolate 0.61): -2.03,87.76 103.31,87.88 arc-90 103.63,87.57 103.63,-8 -2.22,-7.49 arc-90 -2.79,-7.3
N$21
  Bottom 0.305: R-IACA3.1 48.81,23.46 OKB3.1
N$22
  Bottom 0.305: R-IACA4.1 54.14,23.46 OKB4.1
N$23
  pour Top (isolate 0.61): -1.91,87.63 103.19,87.63 arc-90 103.5,87.31 103.5,-8 -1.59,-8 arc-90 -1.91,-7.68
O2
  Bottom 0.305: SENSOR.1 86.61,29.21 83.69,26.29 83.69,25.78 83.44,25.53 R-O21.1
P3
  Bottom 0.305: U1.3 77.55,46.69 78.11,47.24 78.11,57.78 X1.2 C-X8A1.2
P4
  Bottom 0.305: U1.4 77.94,46.19 78.74,46.99 78.74,55.88 X1.1 82.72,58.04 C-X8B1.2
P5
  Bottom 0.305: U1.5 78.46,45.69 79.5,46.74 79.5,52.58 X2.2 81.41,53.98 82.42,54.99 84.29,54.99 C-X8A.2
P6
  Bottom 0.305: U1.6 78.72,45.19 80.9,47.37 X2.1 82.3,49.15 82.93,48.51 84.29,48.51 C-X8B.2
P14
  Bottom 0.305: U1.14 78.19,41.19 78.19,41.61 78.99,42.42 R-TPS1.2 R-TPS2.2 C-TPS.1
P15
  Bottom 0.305: U1.15 77.8,40.69 78.23,40.26 78.23,37.47 78.87,36.83 R-MAP1.2 R-MAP2.2 C-MAP.1
P16
  Bottom 0.305: U1.16 76.65,40.19 77.6,39.24 77.6,32.51 79.12,30.99 R-CLT1.2 R-CLT2.2 C-CLT.1
P17
  Bottom 0.305: U1.17 73.22,38.67 73.53,38.99 76.58,38.99 76.96,38.61 76.96,27.94 79.25,25.65 80.05,25.65 R-O21.2 R-O22.2 C-O2.1
P23
  Bottom 0.305: U1.23 70.22,37.1 71.12,36.2 71.5,36.2 71.75,35.94 | 71.75,35.94 OK-ICU.4 | 71.75,35.94 73.75,35.94 R-ICU5.2
P33
  Bottom 0.305: U1.33 55.43,40.19 52.45,37.21 OKB4.2
P34
  Bottom 0.305: U1.34 53.52,40.69 47.12,34.29 OKB3.2
P35
  Bottom 0.305: U1.35 53.38,41.19 47.75,35.56 44.45,35.56 41.78,32.89 OKB2.2
P36
  Bottom 0.305: U1.36 52.74,41.69 47.24,36.2 41.66,36.2 36.2,30.73 OKB1.2
P37
  Bottom 0.305: U1.37 52.42,42.19 48.39,46.23 OKA4.2
P38
  Bottom 0.305: U1.38 52.69,42.69 50.42,44.96 50.42,49.78 48.51,51.69 OKA3.2
P39
  Bottom 0.305: U1.39 53.07,43.19 51.31,44.96 51.31,54.48 48.64,57.15 OKA2.2
P40
  Bottom 0.305: U1.40 53.72,43.69 52.07,45.34 52.07,55.63 48.39,59.31 48.39,61.59 47.37,62.61 43.81,62.61 OKA1.2
P41
  Bottom 0.305: U1.41 54.74,44.19 52.83,46.1 52.83,56.01 49.15,59.69 49.15,61.85 46.74,64.26 46.74,65.41 46.23,65.91 L-RUN.C
P42
  Bottom 0.305: U1.42 55.51,44.69 53.85,46.35 53.85,57.78 55.6,59.54 IC1.5
P43
  Bottom 0.305: U1.43 56.03,45.19 55.12,46.1 55.12,56.77 58.2,59.85 IC1.1
P46
  Bottom 0.305: U1.46 59.35,46.69 57.72,48.32 57.4,48.64 SWD.1
P49
  Bottom 0.305: U1.49 63.13,49.64 62.48,50.29 SWD.3
P58
  Bottom 0.305: U1.58 70.22,50.56 67.44,53.34 67.44,56.94 R-VDDO.1
P59
  Bottom 0.305: U1.59 70.72,50.95 68.33,53.34 68.33,55.75 69.09,56.52 69.09,60.45 72.9,64.26 76.96,64.26 77.72,63.5 77.72,62.48 OKC.2
PUMP
  Bottom 0.305: R-PUMPC.2 75.6,76.87 PUMP_PIN.1 80.77,75.69 Q5.2
TPS
  Bottom 0.305: SENSOR.4 86.23,36.83 84.58,38.48 84.58,41.53 83.82,42.29 81.88,42.29 R-TPS1.1
V12  (via drill 0.6)
  Top 0.305: v37.47,5.33 61.47,5.33 v62.61,6.48
  Bottom 0.305: R-PUMPC.1 R-PUMPB.1 77.3,73.06 78.57,73.06 arc-45 78.79,72.97 79.12,72.64 79.12,71.38 arc45 79.21,71.15 79.76,70.61 92.2,70.61 arc45 92.42,70.7 92.71,70.99 92.71,80.26 arc45 92.62,80.48 92.2,80.9 75.95,80.9 74.3,79.25 64.77,79.25 62.23,81.79 42.16,81.79 41.66,81.28 41.66,77.47 41.27,77.09 24.26,77.09 | R-FETB1.1 31.62,64.26 30.35,62.99 26.92,62.99 26.04,62.1 | 26.04,62.1 26.04,58.17 | 26.04,58.17 26.04,45.85 | 26.04,45.85 26.04,34.29 | R-FETB4.1 30.95,33.66 26.67,33.66 26.04,34.29 | R-FETB3.1 31.88,45.97 31.5,45.59 26.29,45.59 26.04,45.85 | R-FETB2.1 31.88,58.29 31.5,57.91 26.29,57.91 26.04,58.17 | R-FETC1.1 11.94,61.21 9.53,58.8 9.53,55.88 8.89,55.24 5.33,55.24 4.83,54.74 | 4.83,54.74 4.83,52.7 | 4.83,52.7 4.83,50.16 | 4.83,50.16 4.95,50.04 8.89,50.04 9.65,49.28 9.65,45.09 10.67,44.07 11.77,44.07 R-FETC3.1 | R-FETC2.1 11.94,53.21 11.3,52.58 4.95,52.58 4.83,52.7 | R-FETC4.1 11.01,31.79 9.14,33.66 9.14,40.89 7.11,42.93 7.11,45.21 4.83,47.5 4.83,50.16 | 26.04,62.1 26.04,63.12 24.38,64.77 24.38,76.96 24.26,77.09 | 4.83,54.74 4.83,69.85 12.45,77.47 23.88,77.47 24.26,77.09 | IC4.8 37.85,5.71 v37.47,5.33 | v62.61,6.48 62.61,8.16 IC5.1 | IC5.1 62.97,8.52 C-V12.+ 80.15,8.52 PWR_IN.2 91.95,10.54 92.58,11.18 92.58,13.86 IC2.1 | 26.04,34.29 26.04,26.8 27.94,24.89 29.72,24.89 29.97,24.64 29.97,1.4 33.91,-2.54 55.63,-2.54 60.96,2.79 60.96,7.75 61.59,8.38 62.63,8.38 IC5.1
VCC  (via drill 0.6)
  Top 0.305: v46.35,72.14 46.35,69.47 | 46.35,69.47 v46.35,67.18 | v97.41,45.21 97.41,43.31 arc-45 97.32,43.09 96.39,42.16 96.39,36.32 | 96.39,36.32 96.39,36.2 arc-45 96.3,35.98 v95.63,35.31 | v84.45,15.49 84.45,17.9 arc-45 84.55,18.13 91.31,24.89 92.58,24.89 arc45 92.8,24.98 96.65,28.83 96.65,35.94 arc45 96.55,36.16 96.39,36.32 | v87.12,56.9 87.12,63.49 arc45 87.03,63.72 86.36,64.39 86.36,67.18 arc45 86.27,67.4 85.85,67.82 48.14,67.82 arc-45 47.91,67.91 46.35,69.47
  Bottom 0.305: X0.1 48.5,74.28 v46.35,72.14 | v46.35,67.18 48.01,65.53 51.44,65.53 53,67.1 IC1.20 | v97.41,45.21 95.6,47.02 arc45 95.37,47.12 93.22,47.12 92.55,47.79 arc-45 92.46,48.01 92.46,50.55 91.79,51.22 arc-45 91.69,51.44 91.69,52.2 89.26,54.63 arc-45 89.17,54.86 C-VCC.+ 87.38,56.77 arc-45 87.16,56.86 v87.12,56.9 | v95.63,35.31 93.86,35.31 arc45 93.63,35.21 PWR_OUT.3 | IC2.2 84.87,15.77 arc45 84.64,15.68 v84.45,15.49
VCC_2  (via drill 0.6)
  Top 0.305: 54.48,6.6 55.5,6.6 | 55.5,6.6 55.63,6.73 | 55.5,6.6 v55.63,6.6 | v51.94,11.43 54.23,11.43 54.23,10.54 54.48,10.29 54.48,6.6 | 54.48,6.6 44.32,6.6 v44.2,6.48
  Bottom 0.305: R-IACB4.1 55.63,11.85 IC4.1 55.63,7.49 | R-IACB1.1 39.84,11.39 38.99,10.54 38.99,4.95 | 38.99,4.95 38.99,4.57 37.85,3.43 IC4.9 | IC4.16 v55.63,6.6 55.63,7.49 | IC5.2 56.41,8.28 55.63,7.49 | R-IACB2.1 45.3,11.52 44.2,10.41 v44.2,6.48 44.2,5.08 44.07,4.95 38.99,4.95 | R-IACB3.1 51.31,12.06 v51.94,11.43
VDD  (via drill 0.6)
  Top 0.305: v65.15,51.82 v74.42,51.82 | v77.09,47.75 77.09,45.21 77.72,44.58 87.76,44.58 v88.14,44.96 | v61.72,65.66 45.47,65.66 arc45 45.25,65.57 v44.2,64.52
  Bottom 0.305: U1.1 73.66,47.69 | 73.66,47.69 72.14,47.69 | 72.14,47.69 65.53,47.69 | 65.53,47.69 U1.48 | 73.66,47.69 73.22,48.13 U1.64 73.22,50.87 74.17,51.82 v74.42,51.82 75.31,51.82 77.09,53.59 | 65.53,47.69 65.72,47.51 U1.32 65.72,36.07 | U1.19 72.22,41.53 | 72.22,41.53 72.22,44.7 | 72.22,44.7 72.22,47.61 72.14,47.69 | U1.7 72.23,44.69 72.22,44.7 | U1.13 72.38,41.69 72.22,41.53 | IC1.17 51.05,67.69 50.8,67.44 49.02,67.44 48.77,67.69 48.77,69.72 47.75,70.74 39.75,70.74 39.03,70.02 R-IPWR.2 R-RUN.2 arc45 38.99,65.82 38.99,65.02 39.28,64.74 arc45 39.5,64.64 42.16,64.64 42.2,64.61 arc45 42.42,64.52 v44.2,64.52 | R-ICU4.2 R-ICU3.2 74.13,33.86 R-ICU5.1 70.14,34.08 69.22,33.15 69.22,32 68.83,31.62 67.06,31.62 66.67,32 OK-ICU.6 65.72,35.63 65.72,36.07 | PWR_OUT.2 95.89,32.51 97.66,34.29 97.66,41.78 95.5,43.94 93.3,43.94 D-V33.C 93.09,45.73 C-VDD.+ 88.65,49.15 88.14,48.64 v88.14,44.96 | 77.09,53.59 77.09,55.63 76.07,56.64 70.1,56.64 69.85,56.39 BOOT.1 | v65.15,51.82 65.02,51.94 SWD.4 TR-VDDO.C 65.06,61.59 arc45 65.15,61.81 65.15,64.52 64.1,65.57 arc45 63.88,65.66 v61.72,65.66 58.93,65.66 56.34,63.07 | 77.09,53.59 v77.09,47.75 | 56.25,62.85 arc-45 56.34,63.07 | IC1.4 56.25,62.85 | 56.25,62.85 arc-45 56.34,63.07 | R-ICU7.1 57.57,30.26 arc-45 57.66,30.48 58.42,31.24 58.42,33.02 57.03,33.02 arc-45 56.8,33.11 56.52,33.4 56.52,35.81 arc-45 56.61,36.03 56.9,36.32 65.33,36.32 arc-45 65.56,36.23 65.72,36.07
VDDO  (via drill 0.6)
  Top 0.305: v70.23,58.29 70.23,64.01 62.87,64.01 62.48,63.63 62.48,59.44 62.36,59.31 62.36,59.05 | 62.36,59.05 62.36,58.04 60.83,56.52 53.34,56.52 49.91,53.09 48.64,53.09 v48.26,53.47 | v62.87,59.05 62.36,59.05
  Bottom 0.305: R-FETA1.2 42.97,59.09 42.29,58.42 42.29,53.09 | 42.29,53.09 42.29,47.5 | 42.29,47.5 42.29,42.04 43.05,41.27 45.43,41.27 | 45.43,41.27 R-FETA4.2 | R-FETA3.2 45.89,48.3 45.21,47.62 42.42,47.62 42.29,47.5 | 42.29,53.09 45.59,53.09 46.01,53.51 R-FETA2.2 46.9,53.47 v48.26,53.47 | R-IACA1.2 39.59,24.93 40.39,24.13 40.39,21.08 40.77,20.7 | 40.77,20.7 45.72,20.7 | 45.72,20.7 50.93,20.7 | 50.93,20.7 55.75,20.7 56.52,21.46 56.52,24.85 R-IACA4.2 | R-IACA3.2 50.51,24.93 50.93,24.51 50.93,20.7 | R-IACA2.2 45.3,24.93 45.72,24.51 45.72,20.7 | 45.43,41.27 45.43,41.11 35.05,30.73 35.05,25.78 34.16,24.89 34.16,21.46 34.92,20.7 40.77,20.7 | R-PUMPA.2 76.16,58.76 75.31,57.91 70.61,57.91 v70.23,58.29 | TR-VDDO.E 63.16,59.35 v62.87,59.05
VSS  (via drill 0.6)
  Top 0.305: v68.45,33.15 68.45,32.13 68.96,31.62 | 68.96,31.62 69.22,31.37 | v74.93,27.56 71.12,31.37 69.22,31.37 | v65.79,29.21 68.96,29.21 69.22,29.46 69.22,31.37 | v59.94,49.78 59.94,37.21 61.59,35.56 64.52,35.56 65.41,34.67 65.41,33.15 67.18,31.37 68.71,31.37 68.96,31.62 | v53.21,59.18 v59.69,59.18
  Bottom 0.305: U1.47 61.01,47.19 59.94,48.26 59.94,48.64 | 59.94,48.77 v59.94,49.78 SWD.2 59.98,54.26 arc45 60.07,54.49 60.07,57.28 59.78,57.56 arc-45 59.69,57.79 v59.69,59.18 | R-TPS2.1 C-TPS.2 82.3,38.86 83.19,37.97 83.57,37.97 85.85,35.69 89.92,35.69 | R-MAP2.1 C-MAP.2 81.75,32.89 90.04,32.89 90.81,33.66 | C-CLT.2 R-CLT2.1 81.88,29.34 82.68,29.34 83.69,30.35 89.79,30.35 90.81,31.37 | 89.92,35.69 90.81,34.8 90.81,33.66 | 90.81,33.66 90.81,31.37 | 90.81,31.37 90.81,29.72 | 90.81,29.72 90.81,28.7 89.41,27.3 89.41,24.09 IC2.3 | IC2.3 87.84,23.62 R-O22.1 C-O2.2 81.92,21.68 81.92,20.7 81.53,20.32 76.07,20.32 75.44,20.95 75.44,27.56 | PWR_OUT.1 91.06,29.97 90.81,29.72 | 89.92,35.69 90.93,35.69 91.57,36.32 91.57,37.8 92.22,38.46 | 92.22,38.46 D-V33.A | U1.31 66.22,39.3 66.42,39.5 67.69,39.5 67.69,38.27 U1.28 67.72,37.31 68.33,36.7 68.83,36.7 69.22,36.32 OK-ICU.5 69.22,33.91 v68.45,33.15 | BOOT.3 75.06,54.36 75.06,53.09 74.8,52.83 74.04,52.83 72.72,51.51 U1.63 72.72,48.46 72.64,48.39 60.33,48.39 | 52.7,70.48 53.72,70.48 | 53.72,70.48 56.13,70.48 | 56.13,70.48 56.64,70.48 56.9,70.23 IC1.26 | IC1.25 56.25,70.37 56.13,70.48 | 53.72,70.48 53.65,70.41 IC1.21 53.65,67.38 54.3,66.73 IC1.7 54.3,60.4 arc-45 54.21,60.18 v53.21,59.18 | L-IPWR.C 46.99,68.58 48.77,66.8 51.18,66.8 51.7,67.32 IC1.18 51.7,70.11 52.07,70.48 52.7,70.48 | X0.S2 50.16,78.99 | 50.16,78.99 54.74,78.99 | 54.74,78.99 X0.S1 | X0.4 49.93,78.76 50.16,78.99 | 52.7,70.48 54.61,72.39 54.61,78.87 54.74,78.99 | 84.94,58.57 85.31,58.93 92.84,58.93 93.97,57.8 C-VCC.- 94.47,56.26 C-VDD.- | 84.94,58.57 C-X8B1.1 85.6,57.11 85.6,53.72 85.13,53.25 C-X8A.1 C-X8B.1 85.51,50.25 85.85,49.91 85.85,42.8 85.72,42.67
  Bottom 0.305: C-X8A1.1 84.54,58.97 84.94,58.57 | IC2.3 88.39,14.27 D-V12.A | R-ICU2.1 C-ICU.2 62.27,31.57 | 62.27,31.57 TR-ICU.E | U1.12 77.5,42.19 78.23,42.93 78.23,43.56 78.87,44.2 84.2,44.2 85.72,42.67 | 85.72,42.67 87.63,40.77 87.63,38.86 87.76,38.73 91.95,38.73 92.22,38.46 | U1.18 72.72,37.39 73.03,37.08 75.18,37.08 75.44,36.83 75.44,27.56 | v74.93,27.56 75.44,27.56 | 62.27,31.57 62.27,32.68 62.48,32.89 64.77,32.89 65.41,32.26 65.41,29.59 v65.79,29.21 | 60.33,48.39 59.94,48.77 | 60.33,48.39 60.2,48.39 59.94,48.64 | 59.94,48.64 59.94,48.77
VSS1
  Bottom 0.305: C-ICU1.2 57.02,28.07 56.26,28.83 56.26,31.5 56.64,31.88 57.43,31.88 TR-ICU1.E
(copper drawn outside any net)
  shapes: Bottom circle x4